# Altium schematic sheet P18 GPS.SchDoc
size 246 x 182 mm
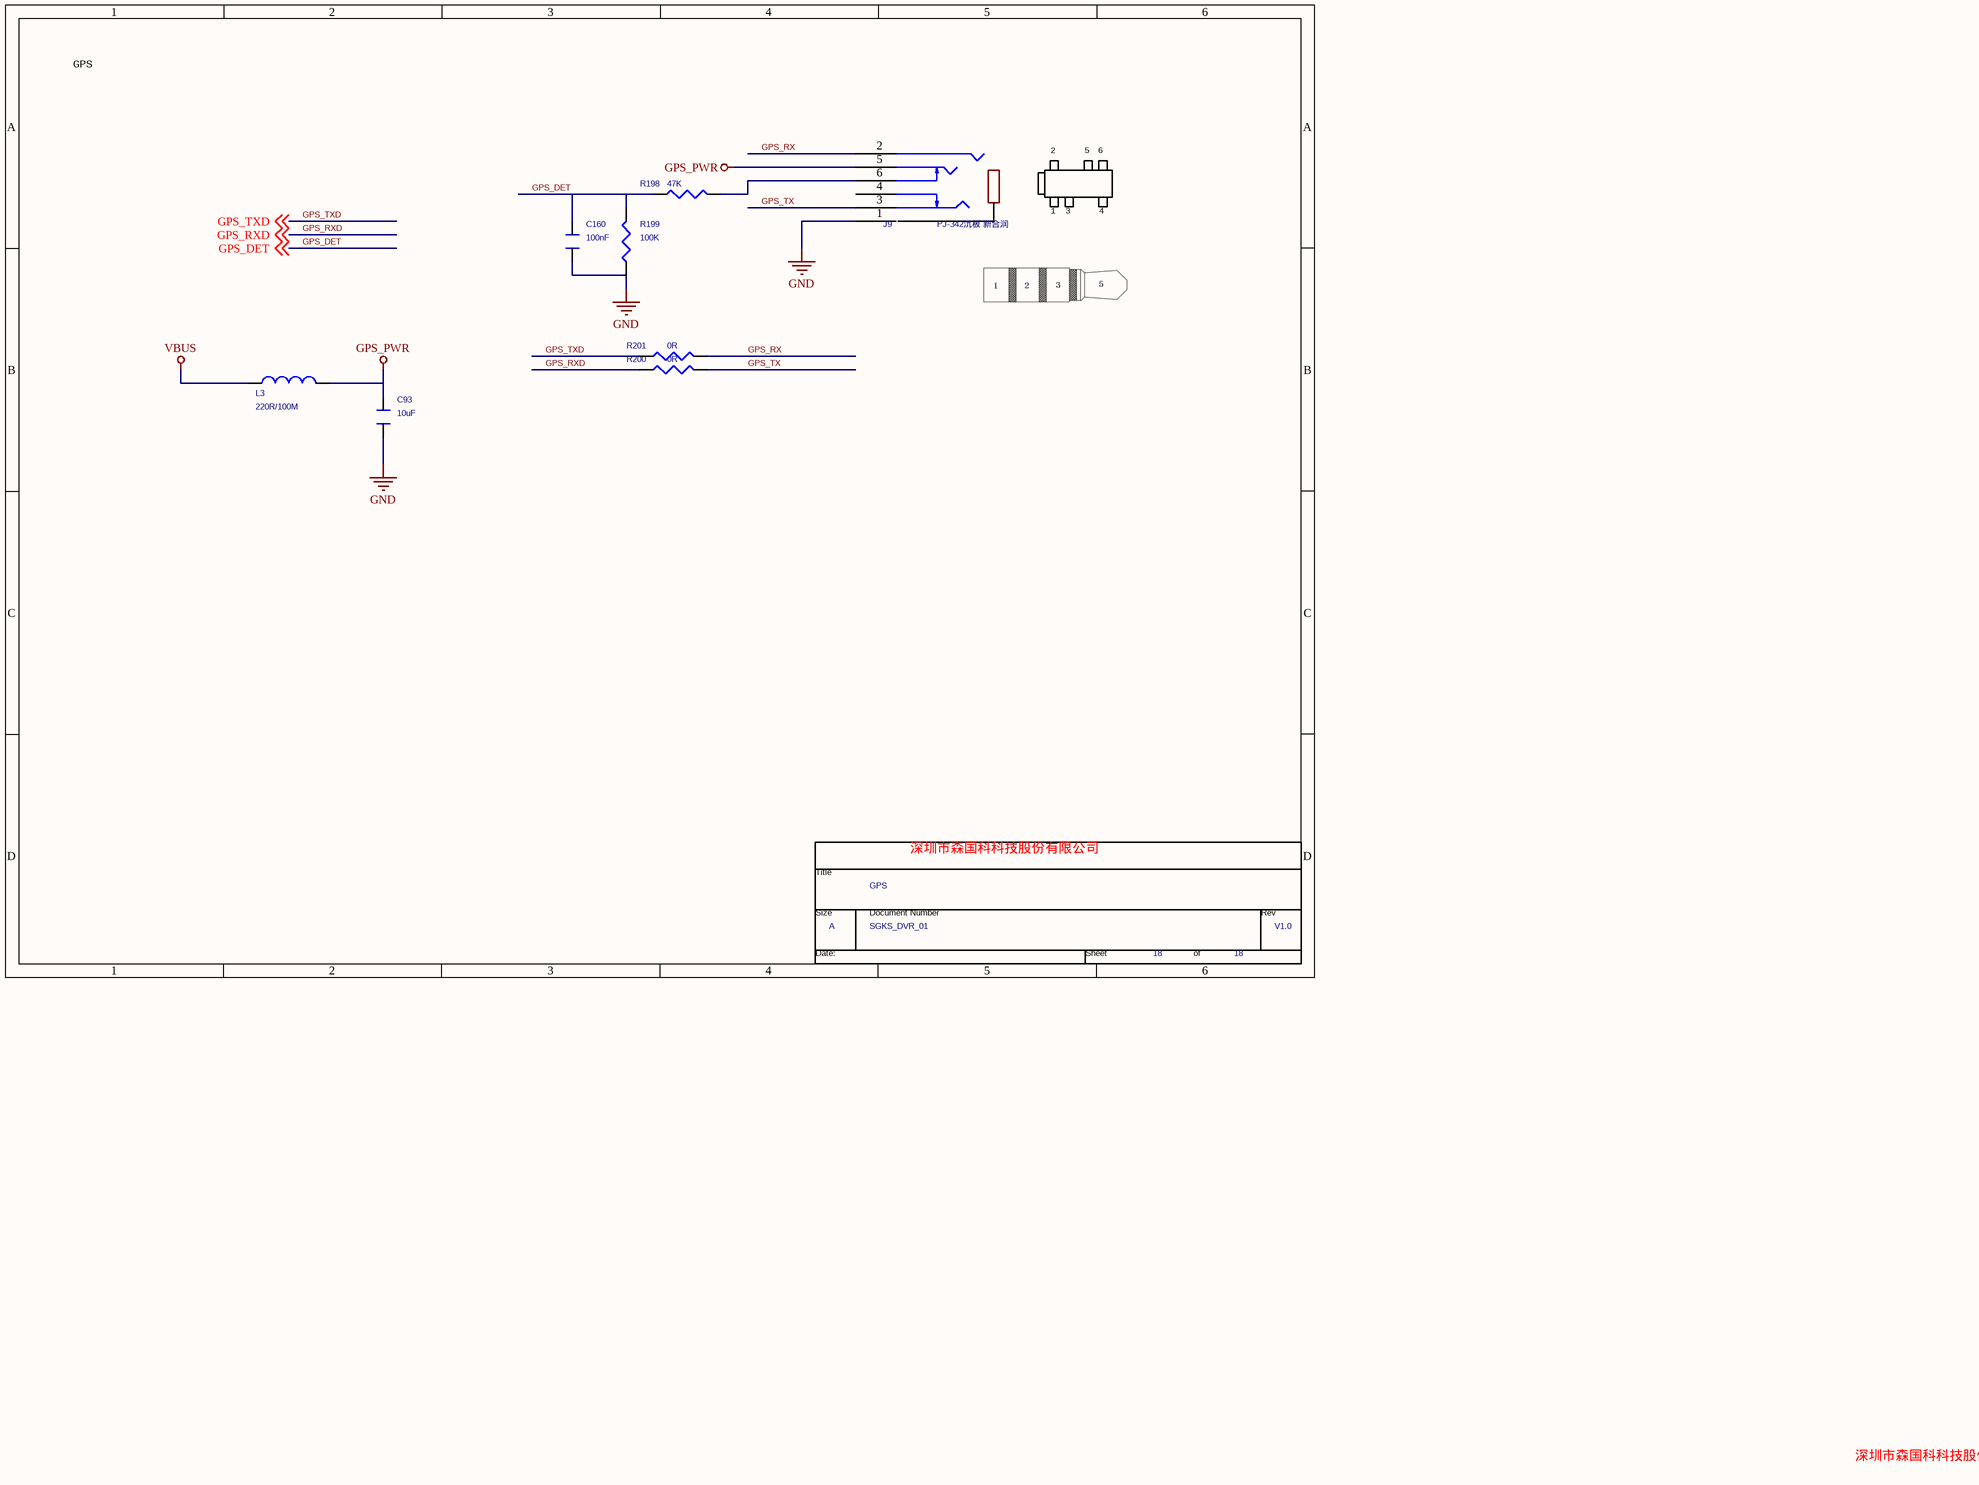
[diagram p0: P18 GPS.SchDoc]

## Parts
*  Page Count: 18  Page Size: A  Title: GPS  RevCode: V1.0  Doc: SGKS_DVR_01  (hidden comment: TitleBlock0)  (graphical)
C93  10uF  [C0603]
C160  100nF  [C0402]
J9  PJ-342沉板 新合润  [TSH-3865D]
L3  220R/100M  [L0402]
R198  47K  [R0603/SMD]
R199  100K  [R0603/SMD]
R200  0R  [R0603/SMD]
R201  0R  [R0603/SMD]

## Nets
GND: C93.1 C160.1 J9.1 R199.1
GPS_PWR: C93.2 J9.5 L3.1
VBUS: L3.2
GPS_DET: C160.2 R198.1 R199.2 ; off-sheet GPS_DET
GPS_RX: J9.2 R201.2
GPS_RXD: R200.1 ; off-sheet GPS_RXD
GPS_TX: J9.3 R200.2
GPS_TXD: R201.1 ; off-sheet GPS_TXD
NetJ9_6: J9.6 R198.2

Not connected (* = marked no-connect by the designer): J9 4

## Notes on the sheet
- GPS
- 2
- 5
- 6
- 1
- 3
- 4
- 深圳市森国科科技股份有限公司
- (in symbol TitleBlock0) Title; Size; Document Number; Rev; Date:; Sheet; of

## Library data of the parts
C93 C160 = CAPACITOR: PAGE: 1
J9 = PHONOJACK_2
L3 = INDUCTOR_2
R198-R201 = RES/SMD_1: Part Description: Chip Resistor; Type: 贴片电阻
* = TitleBlock0: Page Number: 18; Page Create Date: March  8, 1995